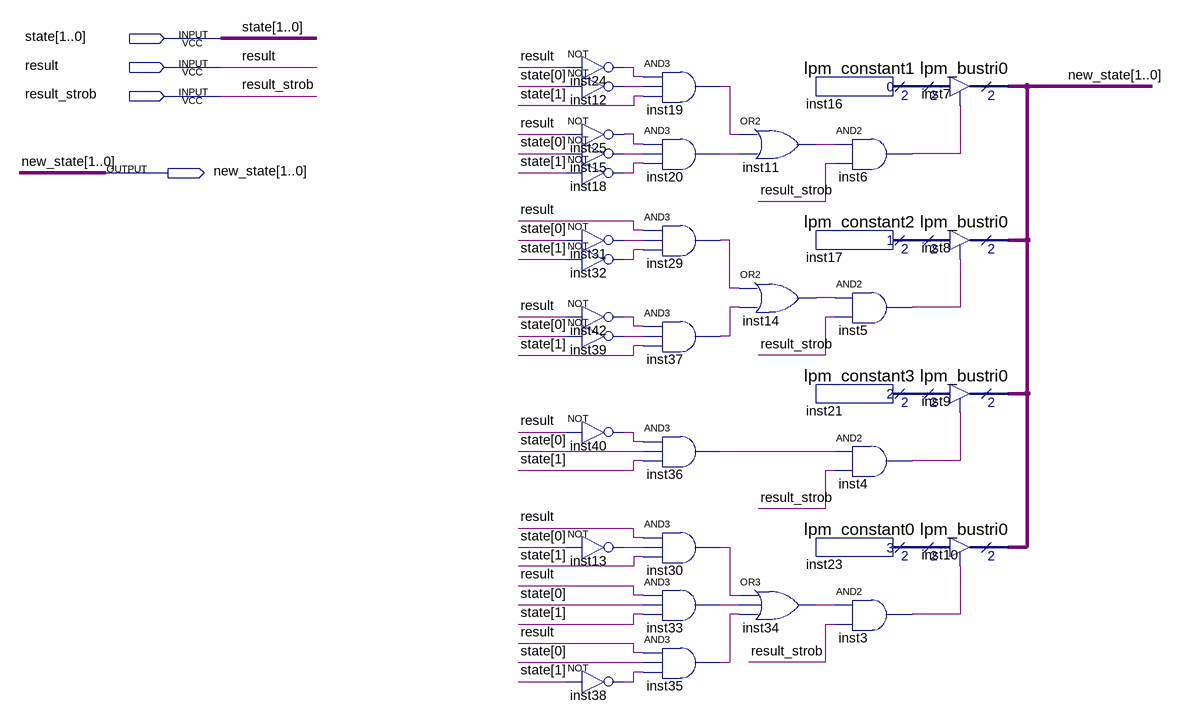
[diagram p0: schematic sheet]
// Quartus schematic MACHINE_A5.bdf as structural Verilog: 35 symbols, 4 pins
module MACHINE_A5 (
  input  [1:0] state,
  input  result,
  input  result_strob,
  output [1:0] new_state
);

  wire inst3_out, inst4_out, inst5_out, inst6_out, inst11_out, inst12_out, inst13_out, inst14_out,
       inst15_out, inst18_out, inst19_out, inst20_out, inst24_out, inst25_out, inst29_out, inst30_out,
       inst31_out, inst32_out, inst33_out, inst34_out, inst35_out, inst36_out, inst37_out, inst38_out,
       inst39_out, inst40_out, inst42_out;
  wire [1:0] inst16_result, inst17_result, inst21_result, inst23_result;

  not inst24 (inst24_out, result);
  not inst12 (inst12_out, state[0]);
  not inst25 (inst25_out, result);
  not inst15 (inst15_out, state[0]);
  not inst18 (inst18_out, state[1]);
  not inst31 (inst31_out, state[0]);
  not inst32 (inst32_out, state[1]);
  not inst42 (inst42_out, result);
  not inst39 (inst39_out, state[0]);
  not inst40 (inst40_out, result);
  not inst13 (inst13_out, state[0]);
  not inst38 (inst38_out, state[1]);
  and inst19 (inst19_out, inst24_out, inst12_out, state[1]);
  and inst20 (inst20_out, inst25_out, inst15_out, inst18_out);
  and inst29 (inst29_out, result, inst31_out, inst32_out);
  and inst37 (inst37_out, inst42_out, inst39_out, state[1]);
  and inst36 (inst36_out, inst40_out, state[0], state[1]);
  and inst30 (inst30_out, result, inst13_out, state[1]);
  and inst33 (inst33_out, result, state[0], state[1]);
  and inst35 (inst35_out, result, state[0], inst38_out);
  or inst11 (inst11_out, inst19_out, inst20_out);
  or inst14 (inst14_out, inst29_out, inst37_out);
  or inst34 (inst34_out, inst30_out, inst33_out, inst35_out);
  lpm_constant1 inst16 (.result(inst16_result));
  lpm_constant2 inst17 (.result(inst17_result));
  lpm_constant3 inst21 (.result(inst21_result));
  lpm_constant0 inst23 (.result(inst23_result));
  and inst6 (inst6_out, inst11_out, result_strob);
  and inst5 (inst5_out, inst14_out, result_strob);
  and inst4 (inst4_out, inst36_out, result_strob);
  and inst3 (inst3_out, inst34_out, result_strob);
  lpm_bustri0 inst7 (.enabledt(inst6_out), .data(inst16_result), .tridata(new_state));
  lpm_bustri0 inst8 (.enabledt(inst5_out), .data(inst17_result), .tridata(new_state));
  lpm_bustri0 inst9 (.enabledt(inst4_out), .data(inst21_result), .tridata(new_state));
  lpm_bustri0 inst10 (.enabledt(inst3_out), .data(inst23_result), .tridata(new_state));
endmodule
